# EAGLE schematic ife_19_Electrical_Tractive_BMS_Slave_v2 (EAGLE 9.1.0)

## Sheet 1 of 5
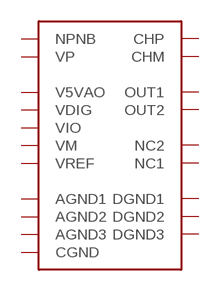
[diagram p0: schematic, sheet 1]

### Parts
U$1  BQ76PL455A  [TQFP80]
Unconnected: U$1.30(DGND1) U$1.31(VM) U$1.32(CHP) U$1.33(CHM) U$1.34(VDIG) U$1.35(DGND2) U$1.36(NC1) U$1.37(DGND3) U$1.41(VIO) U$1.48(CGND) U$1.58(V5VAO) U$1.67(VREF) U$1.68(OUT2) U$1.69(AGND3) U$1.70(VP) U$1.71(NPNB) U$1.72(AGND2) U$1.73(OUT1) U$1.74(AGND1) U$1.75(NC2)

## Sheet 2 of 5
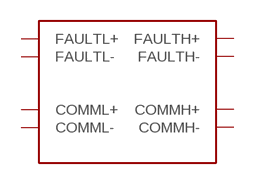
[diagram p1: schematic, sheet 2]
Unconnected: U$1.50(FAULTL+) U$1.51(FAULTL-) U$1.52(COMML+) U$1.53(COMML-) U$1.54(COMMH-) U$1.55(COMMH+) U$1.56(FAULTH-) U$1.57(FAULTH+)

## Sheet 3 of 5
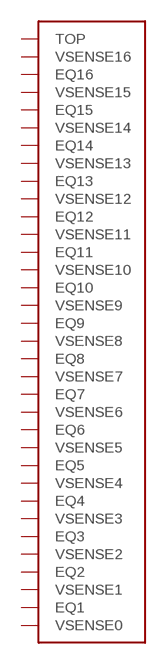
[diagram p2: schematic, sheet 3]
Unconnected: U$1.1(VSENSE14) U$1.2(EQ14) U$1.3(VSENSE13) U$1.4(EQ13) U$1.5(VSENSE12) U$1.6(EQ12) U$1.7(VSENSE11) U$1.8(EQ11) U$1.9(VSENSE10) U$1.10(EQ10) U$1.11(VSENSE9) U$1.12(EQ9) U$1.13(VSENSE8) U$1.14(EQ8) U$1.15(VSENSE7) U$1.16(EQ7) U$1.17(VSENSE6) U$1.18(EQ6) U$1.19(VSENSE5) U$1.20(EQ5) U$1.21(VSENSE4) U$1.22(EQ4) U$1.23(VSENSE3) U$1.24(EQ3) U$1.25(VSENSE2) U$1.26(EQ2) U$1.27(VSENSE1) U$1.28(EQ1) U$1.29(VSENSE0) U$1.76(TOP) U$1.77(VSENSE16) U$1.78(EQ16) U$1.79(VSENSE15) U$1.80(EQ15)

## Sheet 4 of 5
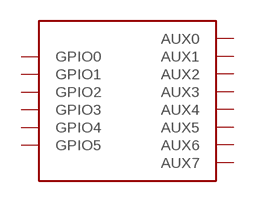
[diagram p3: schematic, sheet 4]
Unconnected: U$1.42(GPIO5) U$1.43(GPIO4) U$1.44(GPIO3) U$1.45(GPIO2) U$1.46(GPIO1) U$1.47(GPIO0) U$1.59(AUX7) U$1.60(AUX6) U$1.61(AUX5) U$1.62(AUX4) U$1.63(AUX3) U$1.64(AUX2) U$1.65(AUX1) U$1.66(AUX0)

## Sheet 5 of 5
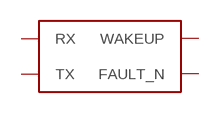
[diagram p4: schematic, sheet 5]
Unconnected: U$1.38(TX) U$1.39(RX) U$1.40(FAULT_N) U$1.49(WAKEUP)

## Library data of the parts
U$1 = bq76pl455a:BQ76PL455A